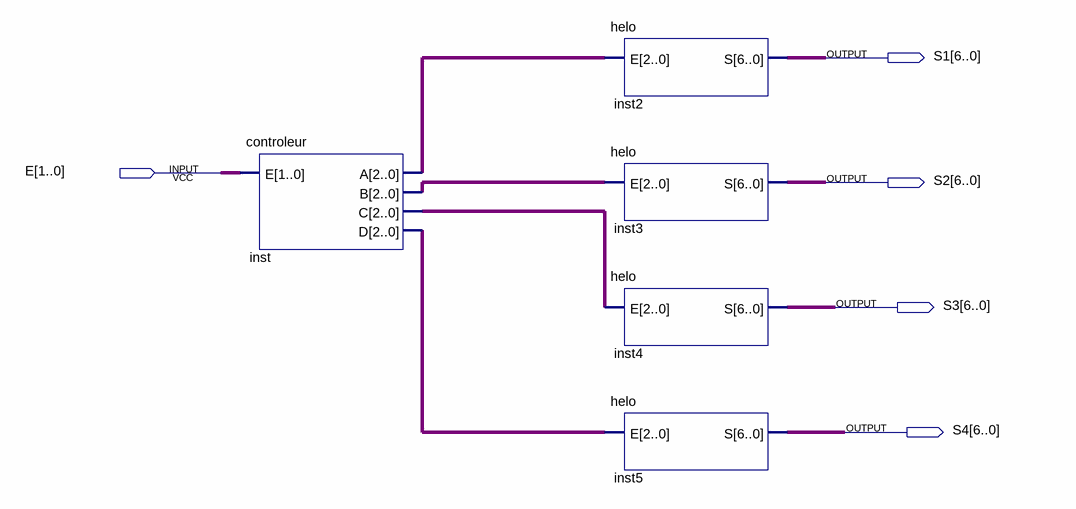
[diagram p0: schematic sheet]
// Quartus schematic controleur_SCHEME.bdf as structural Verilog: 5 symbols, 5 pins
module controleur_SCHEME (
  input  [1:0] E,
  output [6:0] S1,
  output [6:0] S2,
  output [6:0] S3,
  output [6:0] S4
);

  wire [2:0] inst_a, inst_b, inst_c, inst_d;

  controleur inst (.E(E), .A(inst_a), .B(inst_b), .C(inst_c), .D(inst_d));
  helo inst2 (.E(inst_a), .S(S1));
  helo inst3 (.E(inst_b), .S(S2));
  helo inst4 (.E(inst_c), .S(S3));
  helo inst5 (.E(inst_d), .S(S4));
endmodule
